# EAGLE design Alloy (EAGLE 7.5.0)
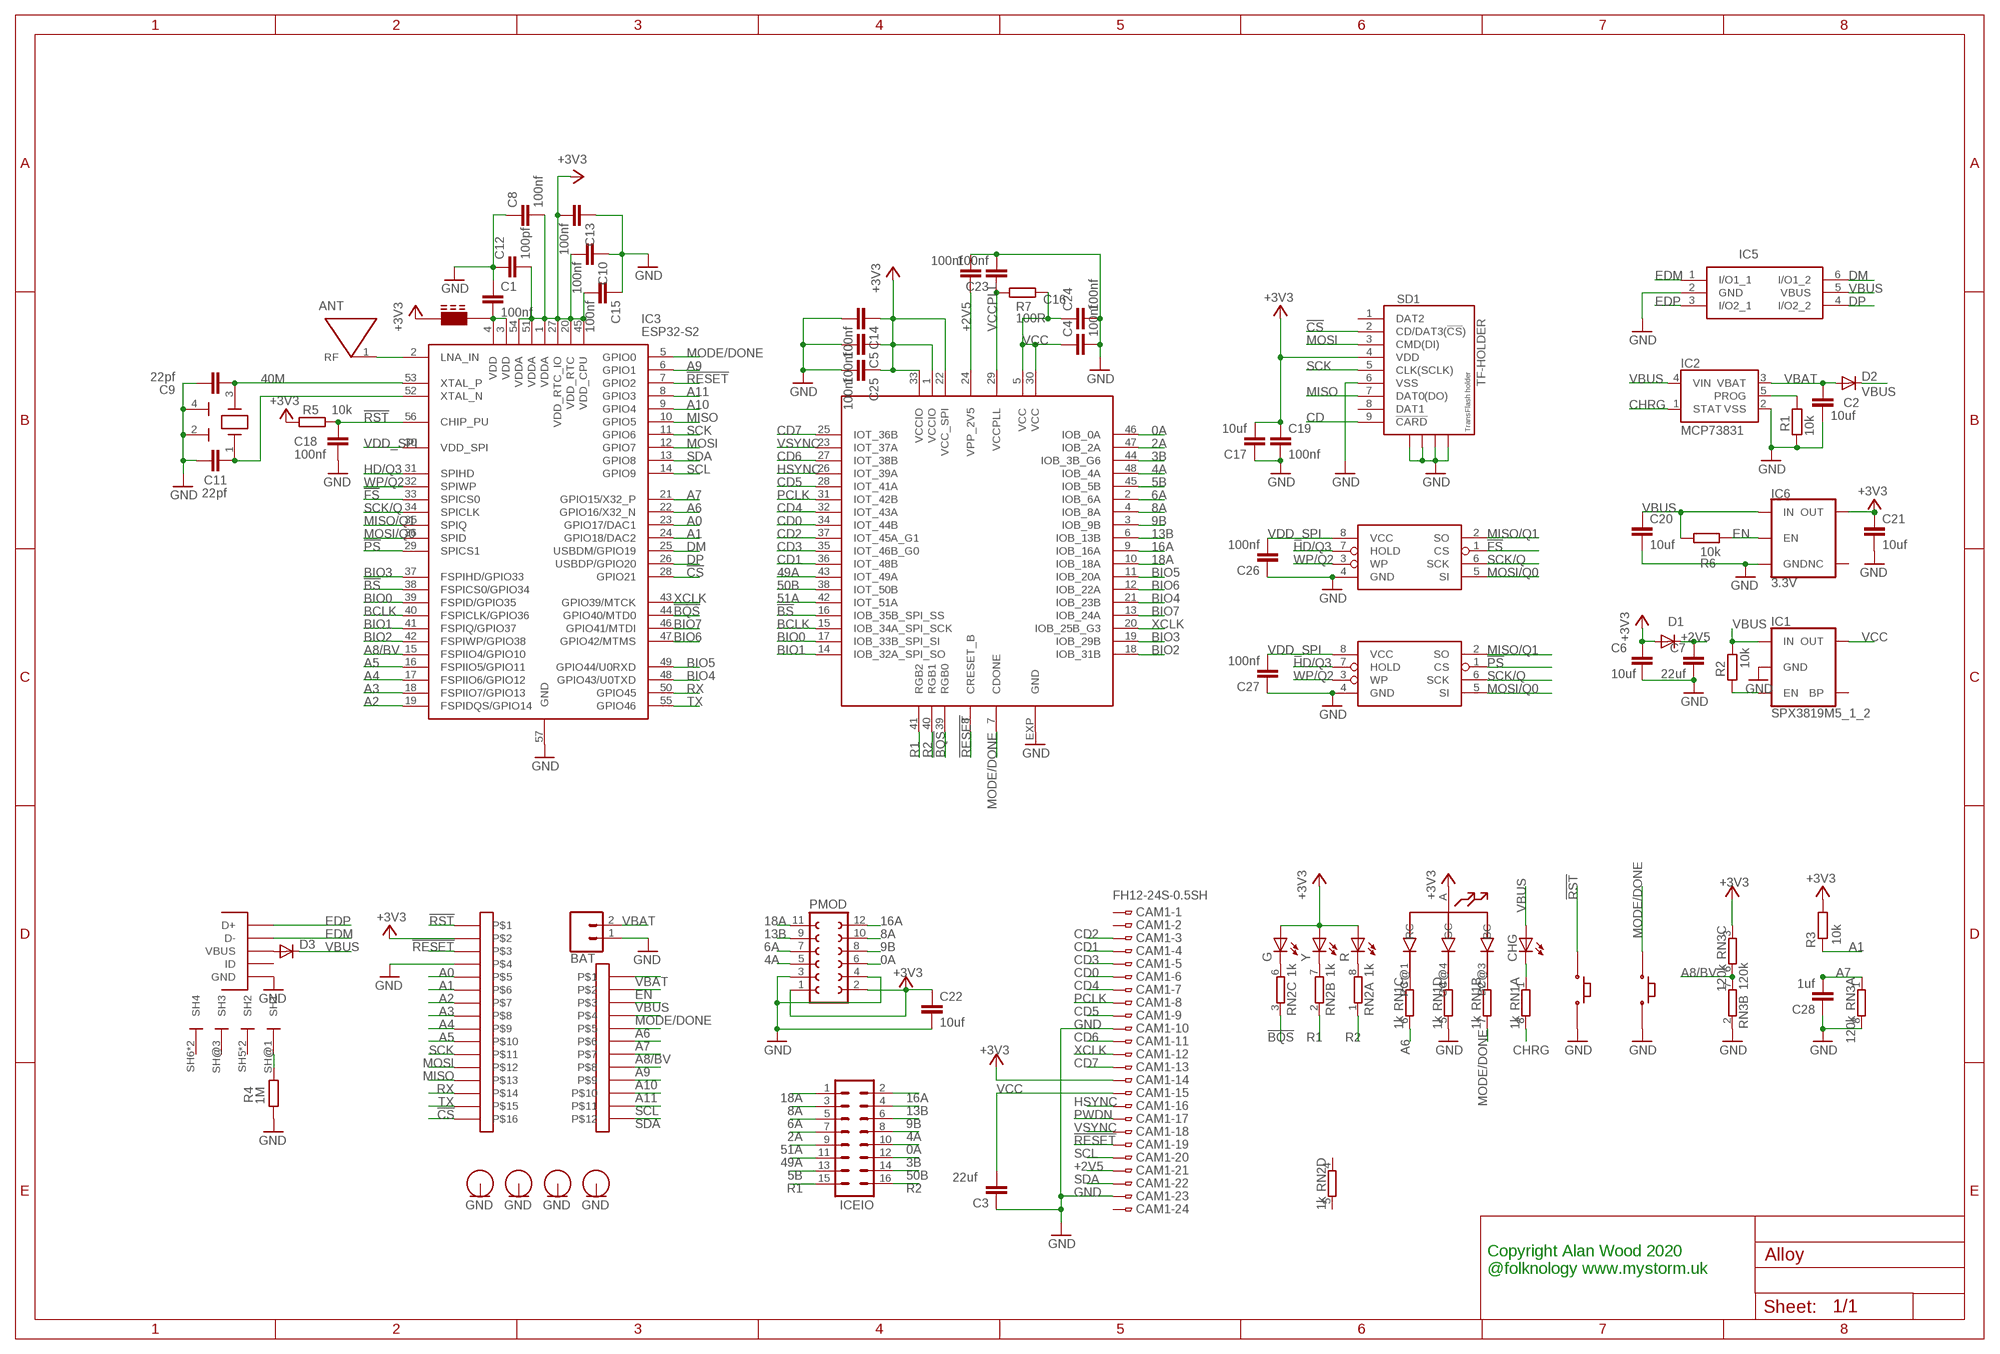
[diagram p0: schematic, sheet 1]

## Parts
ANT  206513-0001  [2065130001]
BAT  CONN_02-JST-2MM-SMT  [JST-2-SMD]
C1  100nf  C-EUC0402  [C0402]
C2  10uf  C-EUC0402  [C0402]
C3  22uf  C-EUC0603  [C0603]
C4  100nf  C-EUC0402  [C0402]
C5  100nf  C-EUC0402  [C0402]
C6  10uf  C-EUC0402  [C0402]
C7  22uf  C-EUC0603  [C0603]
C8  100nf  C-EUC0402  [C0402]
C9  22pf  C-EUC0402  [C0402]
C10  100nf  C-EUC0402  [C0402]
C11  22pf  C-EUC0402  [C0402]
C12  100pf  C-EUC0402  [C0402]
C13  100nf  C-EUC0402  [C0402]
C14  100nf  C-EUC0402  [C0402]
C15  100nf  C-EUC0402  [C0402]
C16  100nf  C-EUC0402  [C0402]
C17  10uf  C-EUC0402  [C0402]
C18  100nf  C-EUC0402  [C0402]
C19  100nf  C-EUC0402  [C0402]
C20  10uf  C-EUC0402  [C0402]
C21  10uf  C-EUC0402  [C0402]
C22  10uf  C-EUC0402  [C0402]
C23  100nf  C-EUC0402  [C0402]
C24  100nf  C-EUC0402  [C0402]
C25  100nf  C-EUC0402  [C0402]
C26  100nf  C-EUC0402  [C0402]
C27  100nf  C-EUC0402  [C0402]
C28  1uf  C-EUC0402  [C0402]
CAM1  FH12-24S-0.5SH  [FH12-24S-0.5SH]
CHG  LEDCHIPLED_0603  [CHIPLED_0603]
D1  DIODE-SOD323-R  [SOD323-R]
D2  DIODE-SOD123  [SOD123]
D3  DIODE-SOD123  [SOD123]
FB1  FERRITE_BEAD0402S  [0402S]
FCL  2.54-HEADER-16WTH-NS  [2.54_HEADER_16W_NS]
FCU  12X1X2.54-HEADERTH-NS  [2.54_HEADER_12W_NS]
G  LEDCHIPLED_0603  [CHIPLED_0603]
H1  HOLE2.5MM  [2.5MM-HOLE]
H2  HOLE2.5MM  [2.5MM-HOLE]
H3  HOLE2.5MM  [2.5MM-HOLE]
H4  HOLE2.5MM  [2.5MM-HOLE]
IC1  SPX3819M5_1_2  V_REG_SPX3819-SOT23-5  [SOT23-5]
IC2  MCP73831  [SOT23-5]
IC3  ESP32-S2  [QFN40P700X700X90-57N]
IC4  ICE40UP5K  [QFN48]
IC5  USBLC6-2SC6  [SOT95P280X145-6N]
IC6  3.3V  V_REG_AP2112K-3.3V  [SOT23-5]
IC7  LY68LXXXX  [SO8]
IC8  AT25SDF041A  [SOIC-8-NARROW]
ICEIO  MA08-2  [MA08-2]
PMOD  FE06-2W  [FE06-2W]
R  LEDCHIPLED_0603  [CHIPLED_0603]
R1  10k  R-EU_R0402  [R0402]
R2  10k  R-EU_R0402  [R0402]
R3  10k  R-EU_R0402  [R0402]
R4  1M  R-EU_R0402  [R0402]
R5  10k  R-EU_R0402  [R0402]
R6  10k  R-EU_R0402  [R0402]
R7  100R  R-EU_R0402  [R0402]
RN1  1k  4R-N0603-ARV  [0603-ARV]
RN2  1k  4R-N0603-ARV  [0603-ARV]
RN3  120k  4R-N0603-ARV  [0603-ARV]
SD1  TF-HOLDER  [TF-PULL]
U$1  RGB-PLCC-4  [PLCC-4-SMALL]
U$2  FCI-MICROUSB-B-PEG  [MICROUSB-B-PEG]
U$3  PUSH_BUTTON  [3X4MM_BUTTON]
U$4  PUSH_BUTTON  [3X4MM_BUTTON]
Y  LEDCHIPLED_0603  [CHIPLED_0603]
Y2  12MZ  7M-25  [CRYSTAL-3.2X2.5]

## Nets
0A: IC4.46(IOB_0A) ICEIO.10 PMOD.6
2A: IC4.47(IOB_2A) ICEIO.7
3B: IC4.44(IOB_3B_G6) ICEIO.12
4A: IC4.48(IOB_4A) ICEIO.8 PMOD.5
5B: IC4.45(IOB_5B) ICEIO.13
6A: IC4.2(IOB_6A) ICEIO.5 PMOD.7
8A: IC4.4(IOB_8A) ICEIO.3 PMOD.10
9B: IC4.3(IOB_9B) ICEIO.6 PMOD.8
13B: IC4.6(IOB_13B) ICEIO.4 PMOD.9
16A: IC4.9(IOB_16A) ICEIO.2 PMOD.12
18A: IC4.10(IOB_18A) ICEIO.1 PMOD.11
40M: C9.2 IC3.53(XTAL_P) Y2.3(X2)
49A: IC4.43(IOT_49A) ICEIO.11
50B: IC4.38(IOT_50B) ICEIO.14
51A: IC4.42(IOT_51A) ICEIO.9
!BQS: IC3.44(GPIO40/MTD0) IC4.39(RGB0) RN2.3
!BS: IC3.38(FSPICS0/GPIO34) IC4.16(IOB_35B_SPI_SS)
!CS: FCL.16 IC3.28(GPIO21) SD1.2(CD/DAT3(!CS!))
!FS: IC3.33(SPICS0) IC8.1(CS)
!PS: IC3.29(SPICS1) IC7.1(CS)
!RESET: CAM1.19 FCL.3 IC3.7(GPIO2) IC4.8(CRESET_B)
!RST: C18.1 FCL.1 IC3.56(CHIP_PU) R5.1 U$3.P$1
+2V5: C7.2 C16.1 CAM1.21 D1.C IC4.24(VPP_2V5)
+3V3: C5.1 C6.1 C8.2 C10.2 C12.2 C13.2 C14.1 C15.2 C17.2 C19.1 C21.1 C22.1 C25.1 CAM1.14 D1.A FB1.1 FCL.2 G.A IC3.1(VDDA) IC3.20(VDD_RTC) IC3.27(VDD_RTC_IO) IC3.45(VDD_CPU) IC3.51(VDDA) IC3.54(VDDA) IC4.1(VCCIO) IC4.22(VCC_SPI) IC4.33(VCCIO) IC6.5(OUT) PMOD.1 PMOD.2 R3.1 R5.2 R.A RN3.3 SD1.4(VDD) U$1.A(ANODE) Y.A
A0: FCL.5 IC3.23(GPIO17/DAC1)
A1: FCL.6 IC3.24(GPIO18/DAC2) R3.2
A2: FCL.7 IC3.19(FSPIDQS/GPIO14)
A3: FCL.8 IC3.18(FSPIIO7/GPIO13)
A4: FCL.9 IC3.17(FSPIIO6/GPIO12)
A5: FCL.10 IC3.16(FSPIIO5/GPIO11)
A6: FCU.5 IC3.22(GPIO16/X32_N) RN1.6
A7: C28.2 FCU.6 IC3.21(GPIO15/X32_P) RN3.1
A8/BV: FCU.7 IC3.15(FSPIIO4/GPIO10) RN3.6 RN3.7
A9: FCU.8 IC3.6(GPIO1)
A10: FCU.9 IC3.9(GPIO4)
A11: FCU.10 IC3.8(GPIO3)
BCLK: IC3.40(FSPICLK/GPIO36) IC4.15(IOB_34A_SPI_SCK)
BIO0: IC3.39(FSPID/GPIO35) IC4.17(IOB_33B_SPI_SI)
BIO1: IC3.41(FSPIQ/GPIO37) IC4.14(IOB_32A_SPI_SO)
BIO2: IC3.42(FSPIWP/GPIO38) IC4.18(IOB_31B)
BIO3: IC3.37(FSPIHD/GPIO33) IC4.19(IOB_29B)
BIO4: IC3.48(GPIO43/U0TXD) IC4.21(IOB_23B)
BIO5: IC3.49(GPIO44/U0RXD) IC4.11(IOB_20A)
BIO6: IC3.47(GPIO42/MTMS) IC4.12(IOB_22A)
BIO7: IC3.46(GPIO41/MTDI) IC4.13(IOB_24A)
CD: SD1.9(!CARD)
CD0: CAM1.6 IC4.34(IOT_44B)
CD1: CAM1.4 IC4.36(IOT_48B)
CD2: CAM1.3 IC4.37(IOT_45A_G1)
CD3: CAM1.5 IC4.35(IOT_46B_G0)
CD4: CAM1.7 IC4.32(IOT_43A)
CD5: CAM1.9 IC4.28(IOT_41A)
CD6: CAM1.11 IC4.27(IOT_38B)
CD7: CAM1.13 IC4.25(IOT_36B)
CHRG: IC2.1(STAT) RN1.8
DM: IC3.25(USBDM/GPIO19) IC5.6(I/O1_2)
DP: IC3.26(USBDP/GPIO20) IC5.4(I/O2_2)
EDM: IC5.1(I/O1_1) U$2.P$2(D-)
EDP: IC5.3(I/O2_1) U$2.P$3(D+)
EN: FCU.2 IC6.3(EN) R6.2
GND: BAT.1 C1.1 C2.2 C3.1 C4.2 C5.2 C6.2 C7.1 C8.1 C9.1 C10.1 C11.1 C12.1 C13.1 C14.2 C15.1 C16.2 C17.1 C18.2 C19.2 C20.2 C21.2 C22.2 C23.2 C24.2 C25.2 C26.1 C27.1 C28.1 CAM1.10 CAM1.23 FCL.4 H1.P$1(P) H2.P$1(P) H3.P$1(P) H4.P$1(P) IC1.2(GND) IC2.2(VSS) IC3.57(GND) IC4.EXP(GND) IC5.2(GND) IC6.2(GND) IC7.4(GND) IC8.4(GND) PMOD.3 PMOD.4 R1.2 R4.2 RN1.5 RN3.2 RN3.8 SD1.6(VSS) SD1.S1 SD1.S2 SD1.S3 SD1.S4 U$2.P$5(GND) U$3.P$2 U$4.P$2 Y2.2(GND) Y2.4(GND)
HD/Q3: IC3.31(SPIHD) IC7.7(HOLD) IC8.7(HOLD)
HSYNC: CAM1.16 IC4.26(IOT_39A)
MISO: FCL.13 IC3.10(GPIO5) SD1.7(DAT0(DO))
MISO/Q1: IC3.35(SPIQ) IC7.2(SO) IC8.2(SO)
MODE/DONE: FCU.4 IC3.5(GPIO0) IC4.7(CDONE) RN1.7 U$4.P$1
MOSI: FCL.12 IC3.12(GPIO7) SD1.3(CMD(DI))
MOSI/Q0: IC3.36(SPID) IC7.5(SI) IC8.5(SI)
N$2: IC2.5(PROG) R1.1
N$3: ANT.1(RF) IC3.2(LNA_IN)
N$4: IC1.3(EN) R2.2
N$5: R.C RN2.8
N$6: RN2.7 Y.C
N$7: C1.2 FB1.2 IC3.3(VDD) IC3.4(VDD)
N$8: G.C RN2.6
N$9: R4.1 U$2.SH@1(SH1)
N$11: CHG.C RN1.1
N$12: D3.A U$2.P$1(VBUS)
N$13: RN1.4 U$1.GC@4(GC)
N$14: RN1.3 U$1.RC@1(RC)
N$15: RN1.2 U$1.BC@3(BC)
N$22: C11.2 IC3.52(XTAL_N) Y2.1(X1)
PCLK: CAM1.8 IC4.31(IOT_42B)
PWDN: CAM1.17
R1: IC4.41(RGB2) ICEIO.15 RN2.2
R2: IC4.40(RGB1) ICEIO.16 RN2.1
RX: FCL.14 IC3.50(GPIO45)
SCK: FCL.11 IC3.11(GPIO6) SD1.5(CLK(SCLK))
SCK/Q: IC3.34(SPICLK) IC7.6(SCK) IC8.6(SCK)
SCL: CAM1.20 FCU.11 IC3.14(GPIO9)
SDA: CAM1.22 FCU.12 IC3.13(GPIO8)
TX: FCL.15 IC3.55(GPIO46)
VBAT: BAT.2 C2.1 D2.A FCU.1 IC2.3(VBAT)
VBUS: C20.1 CHG.A D2.C D3.C FCU.3 IC1.1(IN) IC2.4(VIN) IC5.5(VBUS) IC6.1(IN) R2.1 R6.1
VCC: C3.2 C4.1 C24.1 CAM1.15 IC1.5(OUT) IC4.5(VCC) IC4.30(VCC) R7.1
VCCPLL: C23.1 IC4.29(VCCPLL) R7.2
VDD_SPI: C26.2 C27.2 IC3.30(VDD_SPI) IC7.8(VCC) IC8.8(VCC)
VSYNC: CAM1.18 IC4.23(IOT_37A)
WP/Q2: IC3.32(SPIWP) IC7.3(WP) IC8.3(WP)
XCLK: CAM1.12 IC3.43(GPIO39/MTCK) IC4.20(IOB_25B_G3)
Unconnected: ANT.2 ANT.3 ANT.4 CAM1.1 CAM1.2 CAM1.24 IC1.4(BP) IC6.4(NC) RN2.4 RN2.5 RN3.4 RN3.5 SD1.1(DAT2) SD1.8(DAT1) U$2.P$4(ID) U$2.SH5(SH2) U$2.SH6(SH4) U$2.SH@2(SH2) U$2.SH@3(SH3) U$2.SH@4(SH4)

## Notes on the sheet
- Copyright Alan Wood 2020
  @folknology www.mystorm.uk

## Library data of the parts
ANT = SamacSys_Parts:206513-0001: Antennas 2.4GHz SMT Ceramic Antenna 3x3x4mm Source: Datasheet <https://www.molex.com/pdm_docs/sd/2065130001_sd.pdf>; DESCRIPTION: Antennas 2.4GHz SMT Ceramic Antenna 3x3x4mm; HEIGHT: 4mm; MANUFACTURER_NAME: Molex; MANUFACTURER_PART_NUMBER: 206513-0001; MOUSER_PART_NUMBER: 538-206513-0001; MOUSER_PRICE-STOCK: https://www.mouser.co.uk/ProductDetail/Molex/206513-0001?qs=%252BEew9%252B0nqrDcG5R4F0mX1A%3D%3D
BAT = SparkFun-Connectors:CONN_02: Multi connection point. Often used as Generic Header-pin footprint for 0.1 inch spaced/style header connections On any of the 0.1 inch spaced packages, you can populate with these: Break Away Headers - Straight <https://www.sparkfun.com/products/116> (PRT-00116) Break Away Male Headers - Right Angle <https://www.sparkfun.com/products/553> (PRT-00553) Female Headers <https://www.sparkfun.com/products/115> (PRT-00115) Break Away Headers - Machine Pin <https://www.sparkfun.com/products/117> (PRT-00117) Break Away Female Headers - Swiss Machine Pin <https://www.sparkfun.com/products/743> (PRT-00743) For SCREWTERMINALS and SPRING TERMINALS visit here: Screw Terimnals on SparkFun.com <https://www.sparkfun.com/search/results?term=Screw+Terminals> (5mm/3.5mm/2.54mm spacing) This device is also useful as a general connection point to wire up your design to another part of your project. Our various solder wires solder well into these plated through hole pads. Hook-Up Wire - Assortment (Stranded, 22 AWG) <https://www.sparkfun.com/products/11375> (PRT-11375) Hook-Up Wire - Assortment (Solid Core, 22 AWG) <https://www.sparkfun.com/products/11367> (PRT-11367) View the entire wire category on our website here <https://www.sparkfun.com/categories/141> Special notes: Molex polarized connector foot print use with: PRT-08233 with associated crimp pins and housings. 2.54_SCREWTERM for use with PRT-10571. 3.5mm Screw Terminal footprints for PRT-08084 5mm Screw Terminal footprints for use with PRT-08432; PROD_ID: CONN-11443
C1-C28 = rcl:C-EU: CAPACITOR, European symbol
CAM1 = con-hirose:FH12-24S-0.5S: 0.5mm Pitch Connectors For FPC/FFC Source: Data sheet <http://www.hirose.co.jp/cataloge_hp/e58605370.pdf>; MPN: FH12-24S-0.5SH(55); OC_FARNELL: 1324552; OC_NEWARK: 34M6170
CHG G R Y = led:LED: LED OSRAM: - CHIPLED LG R971, LG N971, LY N971, LG Q971, LY Q971, LO R971, LY R971 LH N974, LH R974 LS Q976, LO Q976, LY Q976 LO Q996 - Hyper CHIPLED LW Q18S LB Q993, LB Q99A, LB R99A - SideLED LS A670, LO A670, LY A670, LG A670, LP A670 LB A673, LV A673, LT A673, LW A673 LH A674 LY A675 LS A676, LA A676, LO A676, LY A676, LW A676 LS A679, LY A679, LG A679 - Hyper Micro SIDELED® LS Y876, LA Y876, LO Y876, LY Y876 LT Y87S - SmartLED LW L88C, LW L88S LB L89C, LB L89S, LG L890 LS L89K, LO L89K, LY L89K LS L896, LA L896, LO L896, LY L896 - TOPLED LS T670, LO T670, LY T670, LG T670, LP T670 LSG T670, LSP T670, LSY T670, LOP T670, LYG T670 LG T671, LOG T671, LSG T671 LB T673, LV T673, LT T673, LW T673 LH T674 LS T676, LA T676, LO T676, LY T676, LB T676, LH T676, LSB T676, LW T676 LB T67C, LV T67C, LT T67C, LS T67K, LO T67K, LY T67K, LW E67C LS E67B, LA E67B, LO E67B, LY E67B, LB E67C, LV E67C, LT E67C LW T67C LS T679, LY T679, LG T679 LS T770, LO T770, LY T770, LG T770, LP T770 LB T773, LV T773, LT T773, LW T773 LH T774 LS E675, LA E675, LY E675, LS T675 LS T776, LA T776, LO T776, LY T776, LB T776 LHGB T686 LT T68C, LB T68C - Hyper Mini TOPLED® LB M676 - Mini TOPLED Santana® LG M470 LS M47K, LO M47K, LY M47K Source: http://www.osram.convergy.de LUXEON: - LUMILED® LXK2-PW12-R00, LXK2-PW12-S00, LXK2-PW14-U00, LXK2-PW14-V00 LXK2-PM12-R00, LXK2-PM12-S00, LXK2-PM14-U00 LXK2-PE12-Q00, LXK2-PE12-R00, LXK2-PE12-S00, LXK2-PE14-T00, LXK2-PE14-U00 LXK2-PB12-K00, LXK2-PB12-L00, LXK2-PB12-M00, LXK2-PB14-N00, LXK2-PB14-P00, LXK2-PB14-Q00 LXK2-PR12-L00, LXK2-PR12-M00, LXK2-PR14-Q00, LXK2-PR14-R00 LXK2-PD12-Q00, LXK2-PD12-R00, LXK2-PD12-S00 LXK2-PH12-R00, LXK2-PH12-S00 LXK2-PL12-P00, LXK2-PL12-Q00, LXK2-PL12-R00 Source: www.luxeon.com KINGBRIGHT: KA-3528ASYC Source: www.kingbright.com
D1-D3 = diode:DIODE-: DIODE
FB1 = amino:FERRITE_BEAD
FCL = amino:2.54-HEADER-16W
FCU = amino:12X1X2.54-HEADER
H1-H4 = amino:HOLE
IC1 = SparkFun-IC-Power:V_REG_SPX3819: SPX3819 Voltage Regulator 3.3V 500mA, 16V input Datasheet <https://www.exar.com/content/document.ashx?id=22106> SparkFun Products: SparkFun Serial Controlled Motor Driver <https://www.sparkfun.com/products/13911>; PROD_ID: VREG-13321; VALUE: SPX3819M5_3_3
IC2 = SparkFun-IC-Power:MCP73831: MCP73831T Li-Ion, Li-Pol Controller Miniature single cell, fully integrated Li-Ion, Li-polymer charge management controller Datasheet <http://ww1.microchip.com/downloads/en/DeviceDoc/20001984g.pdf> SparkFun Products: SparkFun ESP32 Thing <https://www.sparkfun.com/products/13907> SparkFun 9DoF Razor IMU M0 <https://www.sparkfun.com/products/14001>; PROD_ID: IC-09995
IC3 = SamacSys_Parts:ESP32-S2: SMD WI-FI IC, ESP32-S2, SINGAL-C Source: Datasheet <https://componentsearchengine.com/Datasheets/1/ESP32-S2.pdf>; DESCRIPTION: SMD WI-FI IC, ESP32-S2, SINGAL-C; HEIGHT: 0.9mm; MANUFACTURER_NAME: Espressif Systems; MANUFACTURER_PART_NUMBER: ESP32-S2; MOUSER_PART_NUMBER: 356-ESP32-S2; MOUSER_PRICE-STOCK: https://www.mouser.co.uk/ProductDetail/Espressif-Systems/ESP32-S2?qs=GBLSl2Akirtmlui%2FgtDaSQ%3D%3D
IC4 = amino:ICE40UP5K
IC5 = SamacSys_Parts:USBLC6-2SC6: TVS Diode Array Uni-Directional USBLC6-2SC6 17V, SOT-23 6-Pin Source: Datasheet <http://www.st.com/st-web-ui/static/active/en/resource/technical/document/datasheet/CD00050750.pdf>; DESCRIPTION: TVS Diode Array Uni-Directional USBLC6-2SC6 17V, SOT-23 6-Pin; HEIGHT: 1.45mm; MANUFACTURER_NAME: STMicroelectronics; MANUFACTURER_PART_NUMBER: USBLC6-2SC6; MOUSER_PART_NUMBER: 511-USBLC6-2SC6; MOUSER_PRICE-STOCK: https://www.mouser.co.uk/ProductDetail/STMicroelectronics/USBLC6-2SC6?qs=po45yt2pPpu%2FhNIlwQdTlg%3D%3D
IC6 = SparkFun-IC-Power:V_REG_AP2112: AP2112 - 600mA CMOS LDO Regulator w/ Enable The AP2112 is CMOS process low dropout linear regulator with enable function, the regulator delivers a guaranteed 600mA (min.) continuous load current. Features Output Voltage Accuracy: ±1.5% Output Current: 600mA (Min.) Foldback Short Current Protection: 50mA Enable Function to Turn ON/OFF VOUT Low Dropout Voltage (3.3V): 250mV (Typ.) @IOUT=600mA Excellent Load Regulation: 0.2%/A (Typ.) Excellent Line Regulation: 0.02%/V (Typ.) Low Quiescent Current: 55μA (Typ.) Low Standby Current: 0.01μA (Typ.) Low Output Noise: 50μVRMS PSRR: 100Hz -65dB, 1kHz -65dB OTSD Protection Stable with 1.0μF Flexible Cap: Ceramic, Tantalum and Aluminum Electrolytic Operation Temperature Range: -40°C to 85°C ESD: MM 400V, HBM 4000V; PROD_ID: VREG-12457
IC7 = amino:LY68LXXXX
IC8 = amino:AT25SDF041A
ICEIO = con-lstb:MA08-2: PIN HEADER; OC_FARNELL: unknown; OC_NEWARK: unknown
PMOD = con-lsta:FE06-2W: FEMALE HEADER; OC_FARNELL: unknown; OC_NEWARK: unknown
R1-R7 = resistor:R-EU_: RESISTOR, European symbol
RN1-RN3 = resistor-dil:4R-N: Array Chip Resistor Source: RS Component / Phycomp; OC_FARNELL: unknown; OC_NEWARK: unknown
SD1 = sd-mmc:TF-HOLDER: TF / Micro SD socket is PUSH-PUSH type, the card can be pushed into and auto locked and pushed out by simply press the card. Surface Mounting type.
U$1 = amino:RGB-PLCC-4
U$2 = amino:FCI-MICROUSB-B-PEG
U$3 U$4 = amino:PUSH_BUTTON
Y2 = amino:7M-25

## Board
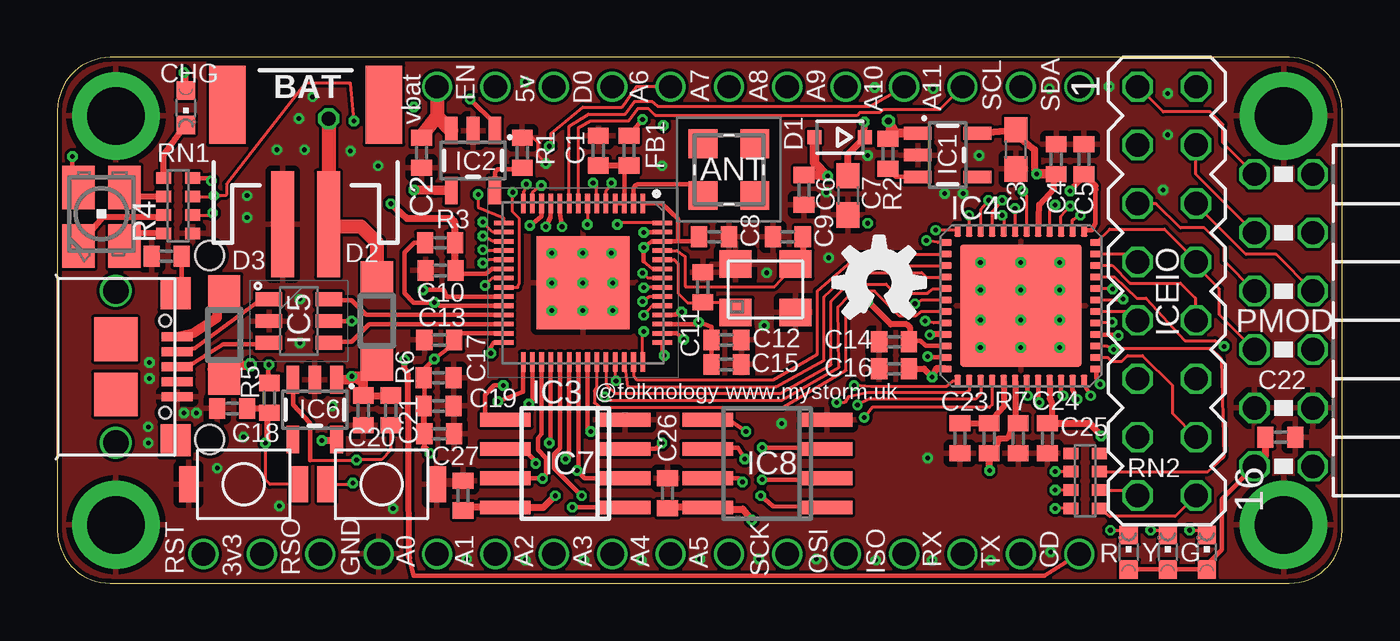
[diagram p1: board, top side]
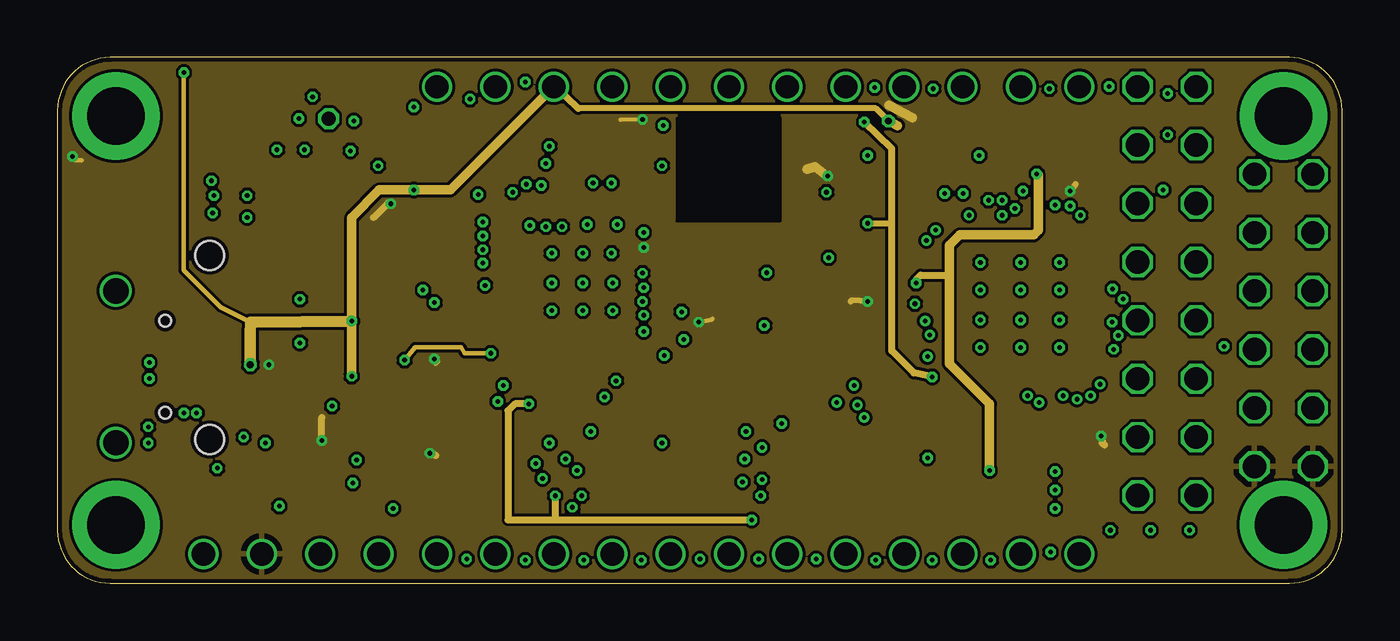
[diagram p2: board, inner layer Route2]
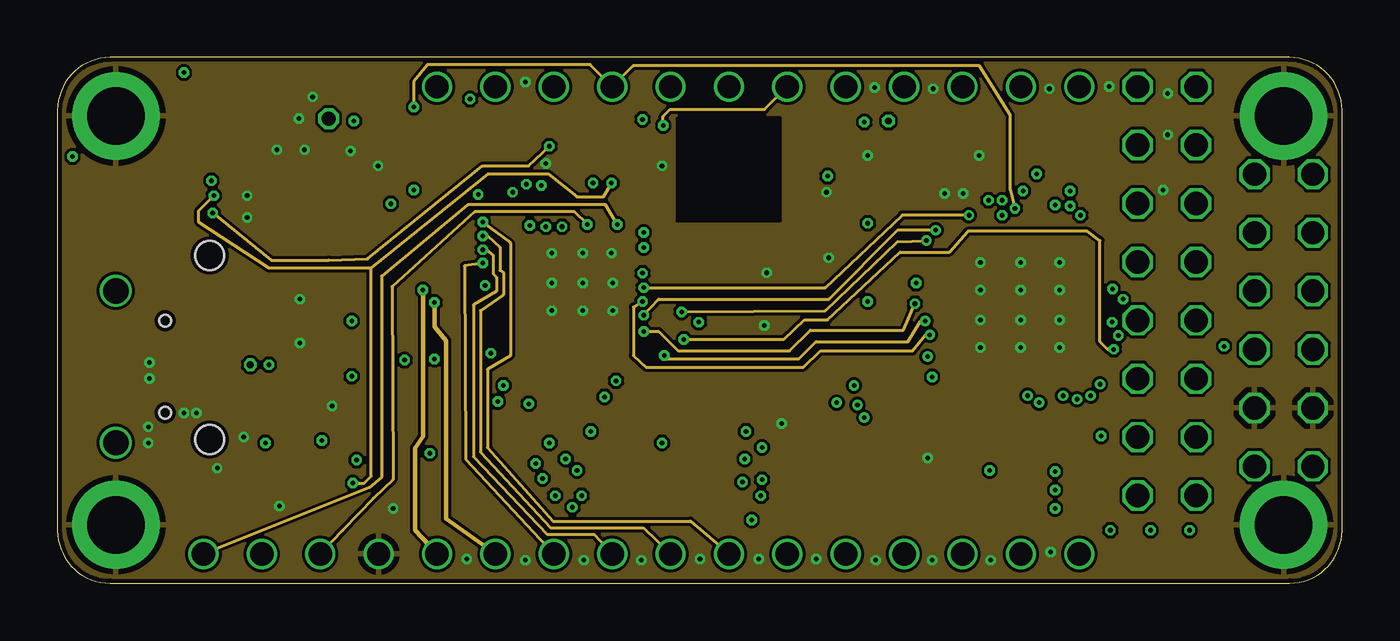
[diagram p3: board, inner layer Route15]
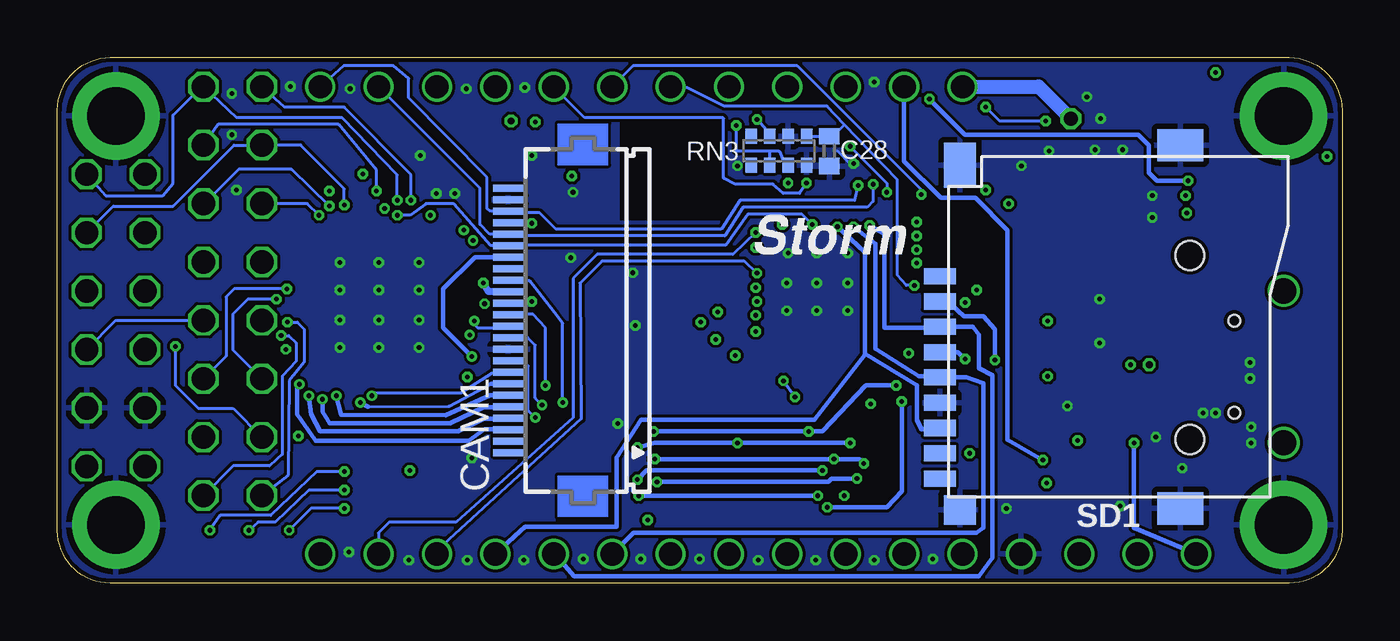
[diagram p4: board, bottom side, seen from below]

Size 55.88 x 22.86 mm. Coordinates in mm from the lower left corner, seen from the top.
Outline: 53.59,22.86 2.29,22.86 arc90 0,20.57 0,2.29 arc90 2.29,0 53.59,0 arc90 55.88,2.29 55.88,20.57 arc90 53.59,22.86
Copper layers (1*2*15*16): Top 0.035559375mm / dielectric 0.17018125mm / Route2 0.01778125mm / dielectric 47mil / Route15 0.01778125mm / dielectric 0.17018125mm / Bottom 0.035559375mm
Design rules "jcl-4layer *": minimum track width 3.5mil, minimum drill 0.2mm, track to track 5mil, track to pad 5mil, pad to pad 5mil, via to via 5mil, smd to smd 5mil, copper to edge 0.2mm, drill to drill 5mil, minimum pad ring 0.15mm, minimum via ring 0.125mm, stop-mask expansion 2.5mil, vias tented up to drill 0.2mm, thermal gap 10mil

### Footprints (pad centres in the part's own frame; a part is rotated, then mirrored left to right if it is on the bottom)
2065130001 = smd 1.25 x 1.25: 1 1.125,-1.125; 2 1.125,1.125; 3 -1.125,1.125; 4 -1.125,-1.125
JST-2-SMD = smd 1 x 4.6: 1 -1,-3.7; 2 1,-3.7 | smd 1.6 x 3.4: NC1 -3.4,1.5; NC2 3.4,1.5
C0402 = smd 0.7 x 0.9: 1 -0.65,0; 2 0.65,0
C0603 = smd 1.1 x 1: 1 -0.85,0; 2 0.85,0
FH12-24S-0.5SH = smd 0.3 x 1.3: 1 -5.75,3.25; 2 -5.25,3.25; 3 -4.75,3.25; 4 -4.25,3.25; 5 -3.75,3.25; 6 -3.25,3.25; 7 -2.75,3.25; 8 -2.25,3.25; 9 -1.75,3.25; 10 -1.25,3.25; 11 -0.75,3.25; 12 -0.25,3.25; 13 0.25,3.25; 14 0.75,3.25; 15 1.25,3.25; 16 1.75,3.25; 17 2.25,3.25; 18 2.75,3.25; 19 3.25,3.25; 20 3.75,3.25; 21 4.25,3.25; 22 4.75,3.25; 23 5.25,3.25; 24 5.75,3.25
CHIPLED_0603 = smd 0.8 x 0.8: A 0,-0.75; C 0,0.75
SOD323-R = smd 0.6 x 0.6: A 1.1,0; C -1.1,0
SOD123 = smd 1.4 x 1.4: A 1.9,0; C -1.9,0
0402S = smd 0.7 x 0.9: 1 -0.65,0; 2 0.65,0
2.54_HEADER_16W_NS = drill 1.016: 1 -19.05,0; 2 -16.51,0; 3 -13.97,0; 4 -11.43,0; 5 -8.89,0; 6 -6.35,0; 7 -3.81,0; 8 -1.27,0; 9 1.27,0; 10 3.81,0; 11 6.35,0; 12 8.89,0; 13 11.43,0; 14 13.97,0; 15 16.51,0; 16 19.05,0
2.54_HEADER_12W_NS = drill 1.016: 1 -13.97,0; 2 -11.43,0; 3 -8.89,0; 4 -6.35,0; 5 -3.81,0; 6 -1.27,0; 7 1.27,0; 8 3.81,0; 9 6.35,0; 10 8.89,0; 11 11.43,0; 12 13.97,0
2.5MM-HOLE = drill 2.5 pad 3.81: P$1 0,0
SOT23-5 = smd 0.55 x 1.2: 1 -0.95,-1.3; 2 0,-1.3; 3 0.95,-1.3; 4 0.95,1.3; 5 -0.95,1.3
QFN40P700X700X90-57N = smd 0.85 x 0.2: 1 -3.45,2.6; 2 -3.45,2.2; 3 -3.45,1.8; 4 -3.45,1.4; 5 -3.45,1; 6 -3.45,0.6; 7 -3.45,0.2; 8 -3.45,-0.2; 9 -3.45,-0.6; 10 -3.45,-1; 11 -3.45,-1.4; 12 -3.45,-1.8; 13 -3.45,-2.2; 14 -3.45,-2.6; 29 3.45,-2.6; 30 3.45,-2.2; 31 3.45,-1.8; 32 3.45,-1.4; 33 3.45,-1; 34 3.45,-0.6; 35 3.45,-0.2; 36 3.45,0.2; 37 3.45,0.6; 38 3.45,1; 39 3.45,1.4; 40 3.45,1.8; 41 3.45,2.2; 42 3.45,2.6 | smd 0.2 x 0.85: 15 -2.6,-3.45; 16 -2.2,-3.45; 17 -1.8,-3.45; 18 -1.4,-3.45; 19 -1,-3.45; 20 -0.6,-3.45; 21 -0.2,-3.45; 22 0.2,-3.45; 23 0.6,-3.45; 24 1,-3.45; 25 1.4,-3.45; 26 1.8,-3.45; 27 2.2,-3.45; 28 2.6,-3.45; 43 2.6,3.45; 44 2.2,3.45; 45 1.8,3.45; 46 1.4,3.45; 47 1,3.45; 48 0.6,3.45; 49 0.2,3.45; 50 -0.2,3.45; 51 -0.6,3.45; 52 -1,3.45; 53 -1.4,3.45; 54 -1.8,3.45; 55 -2.2,3.45; 56 -2.6,3.45 | smd 4.05 x 4.05: 57 0,0
QFN48 = smd 0.55 x 0.3: 1 -3.275,2.75; 2 -3.275,2.25; 3 -3.275,1.75; 4 -3.275,1.25; 5 -3.275,0.75; 6 -3.275,0.25; 7 -3.275,-0.25; 8 -3.275,-0.75; 9 -3.275,-1.25; 10 -3.275,-1.75; 11 -3.275,-2.25; 12 -3.275,-2.75; 25 3.275,-2.75; 26 3.275,-2.25; 27 3.275,-1.75; 28 3.275,-1.25; 29 3.275,-0.75; 30 3.275,-0.25; 31 3.275,0.25; 32 3.275,0.75; 33 3.275,1.25; 34 3.275,1.75; 35 3.275,2.25; 36 3.275,2.75 | smd 0.3 x 0.55: 13 -2.75,-3.275; 14 -2.25,-3.275; 15 -1.75,-3.275; 16 -1.25,-3.275; 17 -0.75,-3.275; 18 -0.25,-3.275; 19 0.25,-3.275; 20 0.75,-3.275; 21 1.25,-3.275; 22 1.75,-3.275; 23 2.25,-3.275; 24 2.75,-3.275; 37 2.75,3.275; 38 2.25,3.275; 39 1.75,3.275; 40 1.25,3.275; 41 0.75,3.275; 42 0.25,3.275; 43 -0.25,3.275; 44 -0.75,3.275; 45 -1.25,3.275; 46 -1.75,3.275; 47 -2.25,3.275; 48 -2.75,3.275 | smd 5.309 x 5.309: EXP 0,0
SOT95P280X145-6N = smd 1.15 x 0.6: 1 -1.3,0.95; 2 -1.3,0; 3 -1.3,-0.95; 4 1.3,-0.95; 5 1.3,0; 6 1.3,0.95
SO8 = smd 0.6 x 2.2: 1 -1.905,-2.6; 2 -0.635,-2.6; 3 0.635,-2.6; 4 1.905,-2.6; 5 1.905,2.6; 6 0.635,2.6; 7 -0.635,2.6; 8 -1.905,2.6
SOIC-8-NARROW = smd 0.6 x 2.2: 1 -1.905,-2.6; 2 -0.635,-2.6; 3 0.635,-2.6; 4 1.905,-2.6; 5 1.905,2.6; 6 0.635,2.6; 7 -0.635,2.6; 8 -1.905,2.6
MA08-2 = drill 1.016 octagon: 1 -8.89,-1.27; 2 -8.89,1.27; 3 -6.35,-1.27; 4 -6.35,1.27; 5 -3.81,-1.27; 6 -3.81,1.27; 7 -1.27,-1.27; 8 -1.27,1.27; 9 1.27,-1.27; 10 1.27,1.27; 11 3.81,-1.27; 12 3.81,1.27; 13 6.35,-1.27; 14 6.35,1.27; 15 8.89,-1.27; 16 8.89,1.27
FE06-2W = drill 1.016 octagon: 1 -6.35,1.27; 2 -6.35,-1.27; 3 -3.81,1.27; 4 -3.81,-1.27; 5 -1.27,1.27; 6 -1.27,-1.27; 7 1.27,1.27; 8 1.27,-1.27; 9 3.81,1.27; 10 3.81,-1.27; 11 6.35,1.27; 12 6.35,-1.27
R0402 = smd 0.7 x 0.9: 1 -0.65,0; 2 0.65,0
0603-ARV = smd 0.5 x 0.65: 1 -1.2,-0.625; 2 -0.4,-0.625; 3 0.4,-0.625; 4 1.2,-0.625; 5 1.2,0.625; 6 0.4,0.625; 7 -0.4,0.625; 8 -1.2,0.625
TF-PULL = smd 0.7 x 1.4: 1 -2.2,-7.62; 2 -1.1,-7.62; 3 0,-7.62; 4 1.1,-7.62; 5 2.2,-7.62; 6 3.3,-7.62; 7 4.4,-7.62; 8 5.5,-7.62; 9 6.6,-7.62 | smd 1.4 x 2: S1 -7.9,2.85; S2 7.9,2.85 | smd 1.28 x 1.4: S3 7.96,-6.75 | smd 1.95 x 1.4: S4 -7.025,-6.75 | hole 1.25: -3.1,3.25; 4.9,3.25
PLCC-4-SMALL = smd 1.4 x 1.9: A -1,1.15; BC@3 1,1.15; GC@4 1,-1.4; RC@1 -1,-1.4
MICROUSB-B-PEG = smd 0.4 x 1.35: P$1 -1.3,2.675; P$2 -0.65,2.675; P$3 0,2.675; P$4 0.65,2.675; P$5 1.3,2.675 | drill 1.1: SH5 -3.3,0; SH6 3.3,0 | smd 1.4 x 1.3: SH@1 -3.2,2.6; SH@4 3.2,2.6 | smd 1.9 x 1.9: SH@2 -1.2,0; SH@3 1.2,0 | hole 0.5: -2,2.15; 2,2.15
3X4MM_BUTTON = smd 0.8 x 1.55: P$1 -2.4,0; P$2 2.4,0
CRYSTAL-3.2X2.5 = smd 1.4 x 1.2: 1 -1.3,-1; 2 1.3,-1; 3 1.3,1.1; 4 -1.3,1.1

### Placement (x,y rotation side)
ANT  29.21,17.98 270 top
BAT  10.79,19.3 0 top
C1  23.53,18.82 270 top
C2  15.84,18.71 270 top
C3  41.7,18.86 90 top
C4  43.45,18.43 90 top
C5  44.65,18.43 90 top
C6  32.47,17.1 270 top
C7  34.4,16.86 90 top
C8  28.57,15.06 180 top
C9  31.77,15.06 0 top
C10  16.66,13.6 0 top
C11  28.07,12.87 270 top
C12  29.09,10.58 180 top
C13  16.61,10.57 0 top
C14  36.4,10.49 180 top
C15  29.09,9.51 180 top
C16  36.4,9.32 180 top
C17  16.58,8.93 180 top
C18  7.59,7.6 180 top
C19  16.58,7.71 0 top
C20  13.3,7.51 270 top
C21  16.61,6.5 0 top
C22  53.2,6.35 0 top
C23  39.26,6.3 270 top
C24  41.8,6.3 270 top
C25  43.06,6.3 270 top
C26  26.54,3.91 270 top
C27  17.64,3.81 270 top
C28  22.3,18.79 90 bottom
CAM1  33.02,11.43 90 bottom
CHG  5.58,20.68 180 top
D1  34.03,19.39 180 top
D2  13.89,11.41 90 top
D3  7.25,10.8 90 top
FB1  24.86,18.82 270 top
FCL  25.4,1.27 0 top
FCU  30.48,21.59 0 top
G  50,1.35 0 top
H1  2.54,20.32 0 top
H2  53.34,20.32 0 top
H3  2.54,2.54 0 top
H4  53.34,2.54 0 top
IC1  38.72,18.61 270 top
IC2  18.08,18.38 180 top
IC3  22.86,13.06 270 top
IC4  41.91,12.06 270 top
IC5  10.5,11.4 0 top
IC6  11.2,7.54 180 top
IC7  22.09,5.2 90 top
IC8  30.88,5.2 90 top
ICEIO  48.26,12.7 270 top
PMOD  53.34,11.43 90 top
R  46.6,1.35 0 top
R1  20.22,18.71 90 top
R2  36.12,18.67 270 top
R3  16.64,14.8 180 top
R4  4.75,14.22 180 top
R5  9.22,8.05 90 top
R6  14.5,7.51 270 top
R7  40.52,6.3 90 top
RN1  5.25,16.41 270 top
RN2  44.7,4.45 90 top
RN3  24.5,18.8 180 bottom
SD1  9.88,11.15 270 bottom
U$1  1.91,16.06 0 top
U$2  2.54,9.41 270 top
U$3  8.1,4.3 180 top
U$4  14.1,4.3 0 top
Y  48.3,1.35 0 top
Y2  30.8,12.78 0 top

### Tracks (layer width: path | path; a pad name or v marks a point on that pad's centre or on a via)
0A
  Top 0.127: IC4.46 45.88,13.81 46.65,13.05 48.85,13.05 49.5,12.4 49.5,11.46 ICEIO.10
  Bottom 0.127: PMOD.6 53.34,11.43 ICEIO.10
2A
  Top 0.127: IC4.47 46.65,14.31 ICEIO.7
3B  (via drill 0.2)
  Top 0.127: IC4.44 45.88,12.81 v45.9,12.8
  Bottom 0.127: v45.9,12.8 48.2,12.8 48.55,12.45 48.55,9.87 ICEIO.12
4A
  Top 0.127: IC4.48 45.77,15.4 48.15,15.4 49.53,14.02 ICEIO.8 49.53,13.82 50.55,12.8 50.55,11.68 PMOD.5
5B  (via drill 0.2)
  Top 0.127: IC4.45 45.98,13.31 46.95,12.4 47.35,12.4 49.05,10.55 50.35,10.55 v50.75,10.3
  Bottom 0.127: v50.75,10.3 50.75,8.6 49.75,7.6 48.24,7.6 ICEIO.13
6A  (via drill 0.2)
  Top 0.127: IC4.2 44.16,15.81 v44.5,16 | PMOD.7 50.75,14.02 50.75,14.6 49.9,15.45 48.85,15.45 47.79,16.51 ICEIO.5
  Bottom 0.127: v44.5,16 45.01,16.51 ICEIO.5
8A  (via drill 0.2)
  Top 0.127: IC4.4 43.16,16.21 v43.4,16.45
  Bottom 0.127: v43.4,16.45 43.4,17.15 45.3,19.05 ICEIO.3 48.2,19.05 50.85,16.4 53.45,16.4 PMOD.10
9B  (via drill 0.2)
  Top 0.127: IC4.3 43.66,15.96 v44.05,16.4 | PMOD.8 53.01,14.3 51.7,14.3 49.53,16.47 ICEIO.6
  Bottom 0.127: v44.05,16.4 45.7,18 48,18 49.49,16.51 ICEIO.6
13B  (via drill 0.2)
  Top 0.127: IC4.6 42.16,16.84 v42,17.05 | PMOD.9 49.53,17.78 ICEIO.4
  Bottom 0.127: v42,17.05 42,17.95 43.65,19.95 48.88,19.95 ICEIO.4
16A  (via drill 0.2)
  Top 0.127: IC4.9 40.66,16.16 v41.1,16.65
  Bottom 0.127: v41.1,16.65 41.1,17.75 43.5,20.25 48.09,20.25 ICEIO.2 49.61,21.59 50.85,20.35 50.85,17.4 51.3,16.85 53.78,16.85 PMOD.12
18A  (via drill 0.2)
  Top 0.127: 40.1,15.4 IC4.10 40.16,16.26 v40.5,16.65 | PMOD.11 50.7,19.15 50.7,19.95 50.15,20.5 48.1,20.5 47.01,21.59 ICEIO.1
  Bottom 0.127: v40.5,16.65 40.5,17.75 43.4,20.7 46,20.7 ICEIO.1
40M
  Top 0.127: IC3.53 26.93,14.46 27.3,14.2 27.3,12.9 31.2,12.9 Y2.3
  Top 0.254: C9.2 32.42,14.2 Y2.3
49A  (via drill 0.2)
  Top 0.127: IC4.43 46.16,12.31 v46.35,12.35
  Bottom 0.127: v46.35,12.35 47.6,12.35 48.25,11.7 48.25,10.15 ICEIO.11
50B
  Top 0.127: IC4.38 45.69,9.81 45.85,9.65 46.3,9.65 46.55,9.9 47.2,9.9 48.5,8.6 48.5,7.38 ICEIO.14
51A
  Top 0.127: 46.85,11.57 ICEIO.9 46.6,11.81 IC4.42
!BQS  (via drill 0.2)
  Top 0.127: IC4.39 45.2,10.3 45.65,10.3 v45.95,10.17 45.98,10.2 50.2,10.2 50.65,9.75 50.75,5.5 50.05,4.85 RN2.3
  Top 0.2: IC3.44 26.93,10.87 v27.25,10.6
  Route15 0.127: v27.25,10.6 31.6,10.6 32.5,11.45 33.5,11.45 36.65,14.4 38.8,14.4 39.6,15.3 44.8,15.3 45.35,14.9 45.35,10.5 45.68,10.17 v45.95,10.17
!BS
  Top 0.127: IC3.38 23.86,8.64 24.25,8.25 31.45,8.25 33.65,9.5 33.65,12.25 34.9,13.5 37.6,13.5 37.8,13.3 IC4.16
!CS  (via drill 0.2)
  Top 0.2: IC3.28 18.96,10.46 18.71,10.04 v18.85,10 | FCL.16 42.93,0.33 15.5,0.33 15.3,1.1
  Top 0.254: 15.3,1.1 15.25,9.1 15.1,9.35 v15.1,9.7
  Route2 0.2: v18.85,10 17.7,10 17.55,10.25 15.55,10.25 v15.1,9.7
  Bottom 0.127: 17,12.1 17.35,12.1 SD1.2
  Bottom 0.2: v15.1,9.7 15.1,11.05 15.6,11.6 16.45,11.6 17,12.1
!FS  (via drill 0.2)
  Top 0.2: IC3.33 21.86,5.86 21.6,5.6 21.6,5 v22.8,3.8 | v30.6,3.8 31.12,3.35 IC8.1
  Bottom 0.2: v22.8,3.8 v30.6,3.8
!PS  (via drill 0.2)
  Top 0.2: IC3.29 20.26,8.31 v19.15,7.9 | v22.4,3.3 IC7.1
  Bottom 0.2: v19.15,7.9 19.15,4 19.8,3.3 v22.4,3.3
!RESET  (via drill 0.2)
  Top 0.127: IC3.7 v23.06,15.61 v23.05,15.6 | v41.1,16 41.16,15.94 IC4.8
  Route15 0.127: v23.05,15.6 22.5,16.15 18.15,16.15 14.55,12.9 14.6,4.5 13.75,3.7 12.41,2.3 FCL.3
  Bottom 0.127: v23.05,15.6 23.5,16.05 25.85,16.05 26.8,14.7 36.25,14.7 CAM1.19 37.03,14.68 38.65,16.5 39.85,16.5 40.55,16 v41.1,16
!RST  (via drill 0.2)
  Top 0.127: IC3.56 24.57,15.66 v24.35,15.6 | U$3.P$1 9.25,4.3 9.05,4.5 v9.05,6.1
  Top 0.2: 9.15,6.2 v9.05,6.1
  Top 0.254: C18.1 9.03,7.6 R5.1 9.15,7.33 9.15,6.2
  Route15 0.127: v24.35,15.6 23.85,16.45 17.85,16.45 14.1,13.35 14.1,4.6 13.55,4.15 6.38,1.27 FCL.1
  Bottom 0.2: v9.05,6.1 9.05,2.42 FCL.1
+2V5  (via drill 0.2)
  Top 0.127: 34.61,17.75 C7.2
  Top 0.254: C16.1 37.7,9.32 v38.05,8.97
  Top 0.305: C7.2 34.4,18.66 D1.C 35.09,19.44 v35.1,20.05 | IC4.24 38.22,9.31 v38.05,8.97
  Route2 0.254: v35.25,15.65 36.2,15.65 36.3,15.75
  Route2 0.305: v38.05,8.97 37.25,9.15 36.3,10.1 36.3,15.75 36.3,18.9 v35.1,20.05
  Bottom 0.254: CAM1.21 35.38,15.68 v35.25,15.65
+3V3  (via drill 0.2)
  Top 0.127: IC3.51 25.89,13.66 25.5,14 | 50.05,0.55 G.A 50,0.8
  Top 0.2: IC4.1 44.99,15.34 45.15,15.65 45.15,17.13 | IC4.22 37.78,10.31 37.55,10.55 37.1,10.55 C14.1 | IC3.27 17.5,10.87 C13.2 17.26,10.26 17.06,10.26 v16.4,9.75 15.93,9.28 C17.2 15.96,8.9 15.96,7.68 | IC3.20 18.91,13.66 18.65,13.45 17.36,13.45 C10.2 | 25.5,14 v25.5,14.6 25.86,14.87 IC3.54 27.05,14.87 | IC3.45 27.77,11.27 v27.9,11.35 28.45,11.15 C12.2 C15.2 | C8.2 27.71,14.87 27.05,14.87 | IC3.1 26.29,16.52 27,15.85 27,14.96 27.05,14.87 | R.A Y.A G.A | 50,0.8 50.65,1.45 50.65,3.66 PMOD.1 | R5.2 9.17,9.18 v9.2,9.5 | 15.96,5.89 C21.1 | C21.1 15.96,7.64 15.9,7.7 15.9,6.55 C21.1 | U$1.A 0.65,17.77 v0.65,18.55 | FB1.1 24.9,19.5 v25.45,20.17
  Top 0.254: IC4.33 43.16,8.04 43.25,7.8 43.25,7.13 C25.1 | C19.1 15.96,7.68 | v44.05,17.05 44.65,17.7 C5.1 45.15,17.28 45.15,17.13 | 37.1,10.55 37.1,11.1 36.95,11.25 36.25,11.25 v35.25,12.25
  Top 0.305: C22.1 52.55,5.56 PMOD.1 | IC6.5 12.1,6.2 v11.5,6.2 | C10.2 17.29,13.62 R3.1 17.29,15.71 17.15,15.85 15.2,15.85 v14.5,16.5 | 15.96,5.89 v16.2,5.65 | C25.1 44.9,6.95 v45.4,6.4
  Top 0.406: C6.1 32.62,17.78 v33.5,17.7 32.93,18.28 D1.A
  Route2 0.127: v25.5,14.6 25.45,14.6 25.35,14.7
  Route2 0.2: v9.2,9.5 9.2,9.65 | v16.4,9.75 16.55,9.65 16.45,9.55 | v0.65,18.55 0.75,18.4 1.05,18.4 | v25.45,20.17 24.5,20.15 | v27.9,11.35 28.45,11.45 28.5,11.5
  Route2 0.254: v44.05,17.05 44.3,17.35 | v35.25,12.25 34.55,12.3 34.5,12.25
  Route2 0.305: v11.5,6.2 11.5,7.2 | v14.5,16.5 14.4,16.55 13.75,15.9 | v16.2,5.65 16.35,5.65 16.45,5.55 | v45.4,6.4 45.45,6.1 45.55,6
  Route2 0.406: v33.5,17.7 32.95,18.1 32.6,18 | 36.17,20.78 37.2,20.25
  Bottom 0.127: RN3.3 24.89,19.52 v25.45,20.17
  Bottom 0.2: SD1.4 16.7,10.05 v16.4,9.75
  Bottom 0.254: CAM1.14 35.37,12.18 v35.25,12.25
  pour Route2: 0.1,22.86 55.88,22.86 55.88,0 0,0 0,22.85
A0  (via drill 0.2)
  Top 0.2: IC3.23 16.93,12.46 16.8,12.75 v15.9,12.75
  Route15 0.2: FCL.5 15.56,2.31 15.56,5.86 15.9,6.4 v15.9,12.75
A1  (via drill 0.2)
  Top 0.2: IC3.24 16.64,12.06 v16.4,12.2 15.5,12.2 15.1,12.6 15.1,14.4 15.51,14.8 R3.2
  Route15 0.2: FCL.6 16.9,2.8 16.9,10.55 16.4,11.15 v16.4,12.2
A2  (via drill 0.2)
  Top 0.127: IC3.19 18.79,14.06 v18.5,13.92
  Route15 0.127: v18.5,13.92 17.7,13.8 17.76,5.4 FCL.7
A3  (via drill 0.2)
  Top 0.127: IC3.18 18.73,14.46 v18.5,14.5
  Route15 0.127: v18.5,14.5 18.65,14.5 18.95,14.25 18.95,13.45 19.1,13.3 19.1,12.7 18.1,12.1 18.1,5.5 21.3,2.12 23.35,2.12 FCL.8
A4  (via drill 0.2)
  Top 0.127: IC3.17 18.93,14.87 v18.5,15.1
  Route15 0.127: v18.5,15.1 18.7,15.1 19.25,14.6 19.25,13.6 19.4,13.5 19.4,12.55 18.4,11.85 18.4,5.7 21.45,2.4 25.49,2.4 FCL.9
A5  (via drill 0.2)
  Top 0.127: IC3.16 18.93,15.27 v18.5,15.7
  Route15 0.127: v18.5,15.7 19.7,14.8 19.7,9.9 18.7,9.3 18.7,5.9 21.55,2.7 27.53,2.7 FCL.10
A6  (via drill 0.2)
  Top 0.127: IC3.22 20.02,12.87 20.1,13.05 20.1,15.85 19.8,16.15 v19.8,17 | v21.4,19 21.45,19.05 21.45,19.55 22.85,20.7 24.55,20.7 25.2,21.6 FCU.5 | RN1.6 6.61,16.01 v6.75,16.1
  Route15 0.127: v6.75,16.1 9.3,14.05 11.8,14.05 13.5,14.1 18.5,18.15 20.5,18.15 v21.4,19
  Bottom 0.127: v21.4,19 19.8,17.4 v19.8,17
A7  (via drill 0.2)
  Top 0.127: IC3.21 18.91,13.27 v18.6,12.95
  Bottom 0.127: v18.6,12.95 18.95,12.95 19.35,13.4 19.35,17.55 21.66,19.93 | 21.66,19.93 22.4,20.74 26.89,20.74 28.5,21.55 29.17,21.55 FCU.6 | 21.66,19.93 22.15,19.44 C28.2 22.32,19.43 RN3.1
A8/BV  (via drill 0.2)
  Top 0.127: v18.3,16.9 18.3,16.35 19.41,15.89 IC3.15
  Route15 0.127: v26.35,19.9 26.35,20.3 26.65,20.6 30.76,20.6 FCU.7
  Bottom 0.127: v18.3,16.9 18.3,17.1 23.7,22.5 30.84,22.5 FCU.7 | v26.35,19.9 26.35,18.8 24.89,18.8 | RN3.7 24.25,18.18 24.45,18.75 24.5,18.8 24.89,18.8 | RN3.6 24.89,18.8
A9  (via drill 0.2)
  Top 0.127: IC3.6 23.46,17.24 v23.3,17.4
  Bottom 0.127: v23.3,17.4 23.6,16.95 24.3,16.95 24.75,17.35 26.4,17.35 26.9,17.6 26.9,20.2 26.95,20.25 32.95,20.25 FCU.8
A10
  Top 0.127: IC3.9 22.26,19.86 23.1,20.4 24.7,20.4 25.1,20.95 25.85,20.95 26.1,20.74 35.34,20.74 FCU.9
A11
  Top 0.127: IC3.8 22.66,19.81 23.2,20.1 24.85,20.1 25.25,20.65 25.7,20.65 26,20.35 34.8,20.35 34.9,20.47 35.8,20.47 35.95,20.6 38.38,20.6 FCU.10
BCLK
  Top 0.127: IC3.40 24.71,9.19 24.8,8.55 31.25,8.55 33.35,9.7 33.35,12.45 34.8,13.8 IC4.15
BIO0  (via drill 0.2)
  Top 0.127: IC3.39 24.26,8.89 v24.3,8.8 | v23.8,8.1 23.95,8.1 24.05,7.95 31.5,7.95 34,9.4 33.95,12 34.9,13 36.05,13 36.45,12.6 37.85,12.6 38.1,12.8 IC4.17
  Bottom 0.127: v24.3,8.8 v23.8,8.1
BIO1
  Top 0.127: IC3.41 25.06,9.04 25.2,8.85 31.15,8.85 33.05,9.95 33.05,12.7 34.9,14.3 IC4.14
BIO2  (via drill 0.2)
  Top 0.127: v37.3,12.15 37.62,12.31 IC4.18 | IC3.42 25.46,10.89 v25.5,10.95
  Route15 0.127: v37.3,12.15 36.8,11 32.75,11 31.85,10.1 27,10.1 26.15,10.95 v25.5,10.95
BIO3
  Top 0.127: IC3.37 23.46,8.5 23.36,8.36 23.36,7.84 23.6,7.65 31.55,7.65 34.3,9.25 34.3,11.95 35.1,12.7 35.55,12.7 36.63,11.62 37.31,11.62 37.6,11.81 IC4.19
BIO4  (via drill 0.2)
  Top 0.127: IC3.48 25.77,12.46 v25.45,12.25
  Top 0.254: IC4.21 38.13,10.81 v37.95,10.8
  Route15 0.127: v25.45,12.25 25.05,12 25.05,9.9 25.6,9.4 32.45,9.4 33.2,10.1 37.2,10.1 37.75,10.8 v37.95,10.8
BIO5  (via drill 0.2)
  Top 0.127: IC3.49 25.54,12.87 v25.5,12.85 | v39.65,16 39.65,15.8 IC4.11
  Route15 0.127: v25.5,12.85 33.4,12.85 36.75,16 v39.65,16
BIO6  (via drill 0.2)
  Top 0.127: IC3.47 25.86,12.06 v25.5,11.65 | IC4.12 38.41,15.34 v38.2,15.35
  Route15 0.127: v25.5,11.65 26.15,12.35 33.55,12.35 36.55,15.35 v38.2,15.35
BIO7  (via drill 0.2)
  Top 0.127: IC4.13 38.28,14.81 v37.8,14.9
  Top 0.2: IC3.46 26.86,11.66 v27.15,11.8
  Route15 0.127: v27.15,11.8 33.4,11.85 36.55,14.85 v37.8,14.9
CD0  (via drill 0.2)
  Top 0.2: IC4.34 43.66,8.39 v43.75,8.15
  Bottom 0.2: v43.75,8.15 43.53,7.33 39,7.3 37.07,8.18 CAM1.6
CD1  (via drill 0.2)
  Top 0.2: IC4.36 44.66,8.64 v44.95,8.15
  Bottom 0.2: v44.95,8.15 44.85,7.35 44.45,6.6 38.45,6.6 37.35,7.15 36.3,7.15 CAM1.4
  Bottom 0.254: 36.4,7.15 CAM1.4
CD2  (via drill 0.2)
  Top 0.2: IC4.37 45.19,8.91 v45.35,8.65
  Bottom 0.2: v45.35,8.65 45.35,8.55 45.45,8.5 45.45,7.35 44.65,6.2 38,6.2 37.3,6.7 36.29,6.7 CAM1.3
CD3  (via drill 0.2)
  Top 0.2: IC4.35 44.16,8.44 v44.35,8
  Bottom 0.2: v44.35,8 44.35,7.45 44.05,6.95 38.8,6.95 37.35,7.65 36.3,7.65 CAM1.5
CD4  (via drill 0.2)
  Top 0.2: IC4.32 v42.7,7.85
  Bottom 0.127: 42.37,7.68 38.85,7.7 37.02,8.68
  Bottom 0.2: v42.7,7.85 42.37,7.68 | 37.02,8.68 CAM1.7
CD5  (via drill 0.2)
  Top 0.127: IC4.28 40.65,7.75 40.55,7.65 35.45,7.65 v35.1,7.2
  Top 0.2: IC4.28
  Bottom 0.127: v35.1,7.2 35.4,7.5 35.4,9.45 35.63,9.68 CAM1.9
  Bottom 0.2: 36.24,9.65 CAM1.9
CD6  (via drill 0.2)
  Top 0.127: IC4.27 40.16,8.21 39.95,8 35.3,8 v34.8,7.75
  Bottom 0.127: CAM1.11 35.43,10.68 35.1,10.35 35.1,8.05 v34.8,7.75
  Bottom 0.2: 36.24,10.65 CAM1.11
CD7  (via drill 0.2)
  Top 0.127: IC4.25 38.94,8.79 38.65,8.55 35.4,8.55 v34.65,8.6
  Bottom 0.127: v34.65,8.6 34.65,11.1 35.2,11.7 36.25,11.7 CAM1.13
CHRG  (via drill 0.2)
  Top 0.2: IC2.1 19.03,19.97 v17.95,21.05 | v6.7,17.5 6.59,17.61 RN1.8
  Bottom 0.2: v17.95,21.05 16.4,19.5 8.85,19.5 8.4,19.05 8.4,17.85 8.05,17.5 v6.7,17.5
DM
  Top 0.2: IC3.25 13.44,11.66 12.8,12.3 11.85,12.3 IC5.6
DP
  Top 0.2: IC3.26 13.56,11.27 12.8,10.5 11.85,10.5 IC5.4
EDM
  Top 0.2: U$2.P$2 5.96,10.21 8.75,12.25 9.15,12.3 IC5.1
EDP
  Top 0.2: U$2.P$3 5.91,9.56 7.2,10.4 9.15,10.4 IC5.3
EN  (via drill 0.2)
  Top 0.127: 11,5.35 v13.01,5.35 v13.02,5.35 13.04,5.38 14.1,5.38 14.5,5.78 R6.2
  Top 0.2: IC6.3 10.24,7.75 11,6.95 11,5.35
  Bottom 0.2: FCU.2 19.05,18.35 17.45,16.75 15.95,16.75 14.55,15.35 14.55,6.24 v13.02,5.35
GND  (via drill 0.2)
  Top 0.127: v21.25,18.25 20.9,18.6 20.9,19.15 20.68,19.36 R1.2
  Bottom 0.127: 21.95,18.8 21.4,18.25 v21.25,18.25
  other vias: 21.5,14.35 22.85,14.35 24.1,14.35 21.5,13.05 22.85,13.05 24.15,13.05 21.5,11.85 22.85,11.85 24.15,11.85 40.15,13.95 41.9,13.95 43.6,13.95 40.15,12.75 41.9,12.75 43.6,12.75 40.15,11.45 41.9,11.45 43.6,11.45 40.15,10.25 41.9,10.25 43.6,10.25 35.25,18.6 26.3,18.15 17.8,1.05 20.35,1 22.9,1 25.4,1 27.95,1.05 30.5,1.05 11.95,7.7 8.1,6.35 14.6,3.25 9.65,3.35 6.95,5 5.5,7.4 6.05,7.4 38.1,21.5 10.55,12.35 13.95,18.15 8.25,15.9 8.25,16.85 9.55,18.85 10.75,18.85 10.5,20.2 11.1,21.15 12.75,18.8 20.35,21.8 43.15,21.5 10.55,10.45 30.75,11.2 33.55,14.15 33.45,17 40.1,18.6 39.4,16.95 48.3,21.3 48.1,17.1 37.85,5.45 31.5,6.95 33,1.05 35.6,1 38.05,1 40.6,1 43.2,1.35 38.6,16.95 35.55,21.55 45.75,21.6 48.3,19.5 30.85,13.5 3.95,6.8 3.95,6.1 4,8.9 4,9.6
  pour Top: 0.1,22.86 55.88,22.86 55.88,0 0,0 0,22.85
  pour Route15: 0.1,22.86 55.88,22.86 55.88,0 0,0 0,22.85
  pour Bottom: 0.1,22.86 55.88,22.86 55.88,0 0,0 0,22.85
HD/Q3  (via drill 0.2)
  Top 0.2: IC3.31 21.06,6.5 20.9,6.3 20.9,5.8 21.26,5.44 21.26,4.74 v21.1,4.55 20.93,4.57 IC7.7 | 27.95,4.5 IC8.7 29.64,4.57 v29.8,4.4
  Bottom 0.2: v21.1,4.55 22.2,4.55 22.35,4.4 v29.8,4.4
HSYNC  (via drill 0.2)
  Top 0.127: IC4.26 39.66,8.36 39.5,8.29 35.25,8.29 34.4,8.1 34.25,7.85 v33.9,7.85
  Bottom 0.127: v33.9,7.85 33.9,11.3 34.25,11.75 35.35,13.15 36.24,13.15 CAM1.16
  Bottom 0.254: 36.3,13.15 CAM1.16
MISO  (via drill 0.2)
  Top 0.2: IC3.10 21.86,16.04 v21.95,15.5
  Bottom 0.2: v21.95,15.5 20.76,14.4 20.76,9.99 | 20.76,9.99 18.5,8.6 18.5,7.1 18.3,6.7 17.55,6.7 SD1.7 | FCL.13 35.75,2.25 35.55,2.45 31.55,2.45 31.55,5.45 30.5,7.1 22.95,7.1 20.76,9.94 20.76,9.99
MISO/Q1  (via drill 0.2)
  Top 0.2: IC3.35 22.66,5.04 v22.6,4.9 22.93,4.57 IC7.2 | v30.65,4.5 33.41,4.5 IC8.2
  Bottom 0.2: v22.6,4.9 30.25,4.9 v30.65,4.5
MODE/DONE  (via drill 0.2)
  Top 0.127: IC3.5 23.86,17.06 v24.1,17.4 | U$4.P$1 12.8,4.3 v12.85,4.35 | RN1.7 6.76,16.81 v6.8,16.85 7.3,16.85 7.35,16.9 7.35,17.35 10.8,21.75 12.75,21.75 v12.9,20.1 | v41.65,16.3 IC4.7 | FCU.4
  Route15 0.127: v12.85,4.35 13.35,4.35 13.65,4.65 13.65,13.7 | 13.65,13.7 18.75,17.8 21.35,17.8 22.6,16.8 23.75,16.8 v24.1,17.4 | 13.65,13.7 9.2,13.7 6.15,15.7 6.15,16.2 v6.8,16.85 | v41.65,16.3 41.45,17.1 41.45,20.35 40.1,22.5 25.04,22.5 FCU.4 23.17,22.55 16.1,22.55 15.5,21.8 v15.5,20.7
  Bottom 0.127: v15.5,20.7 14.9,20.1 v12.9,20.1
MOSI  (via drill 0.2)
  Top 0.2: IC3.12 21.06,15.96 v20.55,15.55
  Bottom 0.2: v20.55,15.55 19.9,15.2 19.9,11.1 17.55,11.1 SD1.3 16.05,11.15 15.8,10.8 15.8,9.35 15.2,9.05 15.2,1.1 15.8,0.3 33.4,0.3 34.09,1.09 34.11,1.09 FCL.12
MOSI/Q0  (via drill 0.2)
  Top 0.2: IC3.36 23.06,6.74 v23.2,6.6 | v29.95,6.6 29.05,7.2 27.98,7.2 IC8.5 | IC7.5 18.6,7.11 18.6,8.2 19,8.6 v19.4,8.6
  Bottom 0.2: v29.95,6.6 v23.2,6.6 22.6,6.6 20.7,8.6 v19.4,8.6
N$2
  Top 0.2: IC2.5 19.03,17.88 19.15,18 20.16,18 R1.1
N$3
  Top 0.2: IC3.2 25.06,17.11 arc-90 25.3,17.35 27.59,17.35 arc-90 ANT.1
N$4
  Top 0.2: R2.2 36.48,17.66 IC1.3
N$5  (via drill 0.2)
  Top 0.127: RN2.8 v43.4,3.25 | v45.8,2.3 46.4,2.3 R.C
  Bottom 0.127: v43.4,3.25 44.85,3.25 v45.8,2.3
N$6  (via drill 0.2)
  Top 0.127: RN2.7 v43.4,4.05 | v47.55,2.3 48.1,2.3 Y.C
  Bottom 0.127: v43.4,4.05 44.95,4.05 46.4,2.65 47.15,2.65 v47.55,2.3
N$7
  Top 0.2: IC3.4 IC3.3 24.66,17.96 FB1.2
  Top 0.254: C1.2 FB1.2
N$8  (via drill 0.2)
  Top 0.127: RN2.6 v43.4,4.85 | v49.25,2.3 49.7,2.3 G.C
  Bottom 0.127: v43.4,4.85 44.6,4.85 46.6,2.95 48.8,2.95 v49.25,2.3
N$9
  Top 0.2: 5.31,12.93 5.39,13.02 R4.1
  Top 0.254: 5.31,12.93 U$2.SH@1
N$10
  cutout Route15: 26.95,20.2 26.95,15.75 31.45,15.75 31.45,20.25 27,20.25
  cutout Route2: 26.95,20.2 26.95,15.75 31.45,15.75 31.45,20.25 27,20.25
N$11
  Top 0.254: RN1.1 4.62,18.62 CHG.C
N$12
  Top 0.406: U$2.P$1 5.91,10.86 6.95,11.55 6.95,12.46 D3.A
N$13
  Top 0.254: RN1.4 3.61,15.21 U$1.GC@4
N$14
  Top 0.254: RN1.3 4.5,15.91 1.96,15.91 U$1.RC@1
N$15
  Top 0.254: RN1.2 3.61,16.81 U$1.BC@3
N$22
  Top 0.127: IC3.52 26.84,14.06 27,13.9 27,12.6 27.4,12.2 28.05,12.2 C11.2 28.98,12.22 Y2.1
PCLK  (via drill 0.2)
  Top 0.2: IC4.31 42.2,8.83 v42.2,8.15
  Bottom 0.127: 42.17,8.28 38.32,8.28 36.95,9.15 36.3,9.15 CAM1.8
  Bottom 0.2: v42.2,8.15 42.17,8.28
R1  (via drill 0.2)
  Top 0.127: 45.22,11.35 v45.88,11.35 | RN2.2 46.8,4.05 ICEIO.15
  Top 0.2: 45.22,11.35 IC4.41
  Bottom 0.127: v45.88,11.35 45.45,11.35 45.15,11.05 45.15,9.6 45.8,8.8 45.85,4.7 ICEIO.15
R2  (via drill 0.2)
  Top 0.127: ICEIO.16 48.62,2.9 45.77,2.9 RN2.1
  Top 0.2: v46.15,10.77 46.03,10.77 46,10.8 45.2,10.8 IC4.40
  Bottom 0.127: v46.15,10.77 45.82,10.77 45.5,10.45 45.5,9.65 46.1,9 46.1,5.6 46.65,5.1 48.24,5.1 ICEIO.16
RX  (via drill 0.2)
  Top 0.127: IC3.50 25.68,13.27 v25.45,13.48
  Bottom 0.127: v25.45,13.48 26,14 32.2,14 33.15,13.05 33.1,7.15 39.37,1.43 FCL.14
SCK  (via drill 0.2)
  Top 0.2: IC3.11 21.46,15.94 v21.25,15.5
  Bottom 0.2: v21.25,15.5 20.3,14.75 20.3,10.2 18.4,9 17.55,9 SD1.5 16.35,8.95 15.6,8.7 15.6,2.4 15.9,2.2 30.82,2.2 FCL.11
SCK/Q  (via drill 0.2)
  Top 0.2: IC3.34 22.26,5.46 v22.1,5.4 | v29.9,5.4 29.6,5.9 27.95,5.9 IC8.6 | v20.8,5.2 20.8,5.3 20.2,5.9 19.55,5.9 IC7.6
  Bottom 0.2: v29.9,5.4 v22.1,5.4 21,5.4 v20.8,5.2
SCL  (via drill 0.2)
  Top 0.127: v20.4,17.35 20.27,17 IC3.14
  Bottom 0.127: v20.4,17.35 20.4,16.6 20.65,16.35 26.05,16.35 26.85,15.1 36.09,15.1 CAM1.20 37.08,15.18 37.5,15.6 37.5,17.18 FCU.11
SDA  (via drill 0.2)
  Top 0.127: IC3.13 20.66,16.99 v21.05,17.3
  Bottom 0.127: v21.05,17.3 21.2,16.65 26.2,16.65 27,15.4 34.2,15.4 34.9,16.1 36.19,16.1 CAM1.22 37.03,16.18 37.2,16.3 37.2,17.65 40.6,21.1 40.6,21.95 41.25,22.5 43.44,22.5 FCU.12
TX  (via drill 0.2)
  Top 0.2: IC3.55 25.57,15.27 v25.5,15.25
  Bottom 0.127: v25.5,15.25 26.5,14.3 32.4,14.3 33.45,13.25 33.45,7.2 38.55,2.65 41.45,2.65 41.91,2.19 FCL.15
VBAT  (via drill 0.6)
  Top 0.406: 11.9,15.5 BAT.2
  Top 0.6: D2.A 13.89,14.8 13.2,15.5 11.9,15.5 | v11.8,20.2 11.8,16.2 11.7,16.1 11.7,15.7 BAT.2 | FCU.1 16.51,20.3 | 16.51,20.3 IC2.3 | C2.1 15.84,19.43 16.51,20.3
  Bottom 0.6: FCU.1 13.19,21.59 v11.8,20.2
VBUS  (via drill 0.2, 0.3)
  Top 0.2: IC5.5 v12.8,11.4 | R2.1 36.12,19.77 v36.15,20.1
  Top 0.254: CHG.A 5.58,22.11 v5.5,22.2
  Top 0.3: C20.1 R6.1
  Top 0.406: D2.C 13.71,9.01 v12.8,9 | IC6.1 12.74,8.85 v12.8,9 | C20.1 13.3,8.74 v12.8,9 | IC2.4 16.42,17.08 v15.5,17.1 | D3.C 6.74,9.3 v8.39,9.5 | IC1.1 36.42,19.58 v36.15,20.1
  Route2 0.2: 8.4,11.35 7.1,12 5.5,13.6 v5.5,22.2
  Route2 0.254: v36.15,20.1 35.6,20.65 22.65,20.65
  Route2 0.305: 22.65,20.65 21.66,21.59 FCU.3
  Route2 0.406: v12.8,9 v12.8,11.4 12.8,15.9 14,17.1 v15.5,17.1 17.1,17.1 FCU.3 | v36.15,20.1 36.55,19.9
  Route2 0.5: v12.8,11.4 8.4,11.35 8.39,10.84 v8.39,9.5
VCC  (via drill 0.2)
  Top 0.254: IC4.5 42.71,16.46 43.35,17.15 43.35,17.59 C4.1 | R7.1 40.83,5.83 40.95,6.3 41.3,6.3 41.4,6.4 41.5,6.66 C24.1 41.66,7.08 IC4.30
  Top 0.305: R7.1 40.52,4.92 v40.55,4.9 | IC1.5 C3.2 41.73,19.46 42.5,18.85 42.5,18 v42.6,17.8
  Top 0.406: v42.6,17.8 43.37,17.8 C4.1
  Route2 0.305: v37.35,13.05 37.35,13.2 37.55,13.4 38.8,13.4
  Route2 0.406: v40.55,4.9 40.55,7.8 38.8,9.55 38.8,13.4 38.8,14.7 39.25,15.15 42.47,15.15 IC4.5 42.66,17.76 v42.6,17.8
  Bottom 0.305: CAM1.15 37.13,12.68 v37.35,13.05
VCCPLL
  Top 0.254: IC4.29 41.16,7.67 R7.2 C23.1
VDD_SPI  (via drill 0.2)
  Top 0.2: 19,3.3 IC7.8 | IC3.30 20.66,7.96 v20.5,7.8
  Top 0.3: IC8.8 26.67,3.29 C26.2 | C27.2 17.88,3.29 IC7.8 21.14,3.29 v21.65,3.8 | 27.8,3.21 29.82,3.21 v30.2,2.75
  Top 0.406: 27.8,3.21 IC8.8
  Route2 0.3: 21.65,2.75 19.6,2.75 19.6,7.5 19.9,7.8 v20.5,7.8 | 21.65,2.75 v30.2,2.75 | v21.65,3.8 21.65,2.75
VSYNC  (via drill 0.2)
  Top 0.2: IC4.23 38.09,9.81 v37.85,9.85
  Bottom 0.2: CAM1.18 37.72,14.18 39.1,12.8 39.1,11.1 v37.85,9.85
WP/Q2  (via drill 0.2)
  Top 0.2: IC3.32 21.46,6.24 v21.4,6.1 | v30.65,5.9 33.41,5.9 IC8.3 | IC7.3 26.04,5.83 v26.3,6.1
  Bottom 0.2: v21.4,6.1 v26.3,6.1 29.9,6.1 v30.65,5.9
XCLK  (via drill 0.2)
  Top 0.127: IC4.20 38.12,11.31 v37.75,11.4
  Top 0.2: IC3.43 26.31,9.99 v26.4,9.9
  Route15 0.127: v26.4,9.9 26.55,9.75 32.25,9.75 33,10.5 37,10.5 37.55,11.4 v37.75,11.4
  Bottom 0.127: v37.75,11.4 37.8,11.3 37.6,11.1 36.35,11.1 CAM1.12
  Bottom 0.2: 36.25,11.2 CAM1.12

### Text on the board
tPlace: EN | 5v | D0 | A6 | A7 | A8 | A9 | A11 | SCL | vbat | A10 | SDA | @folknology www.mystorm.uk | A0 | A1 | A2 | A3 | A4 | A5 | RX | TX | CD | RST | 3v3 | RSO | GND | SCK | OSI | ISO
tStop: Alloy
bDocu: Hardware for / passionate / bit wranglers